# EasyEDA Pro project PCB-WearableGasDetect.epro, schematic Schematic1
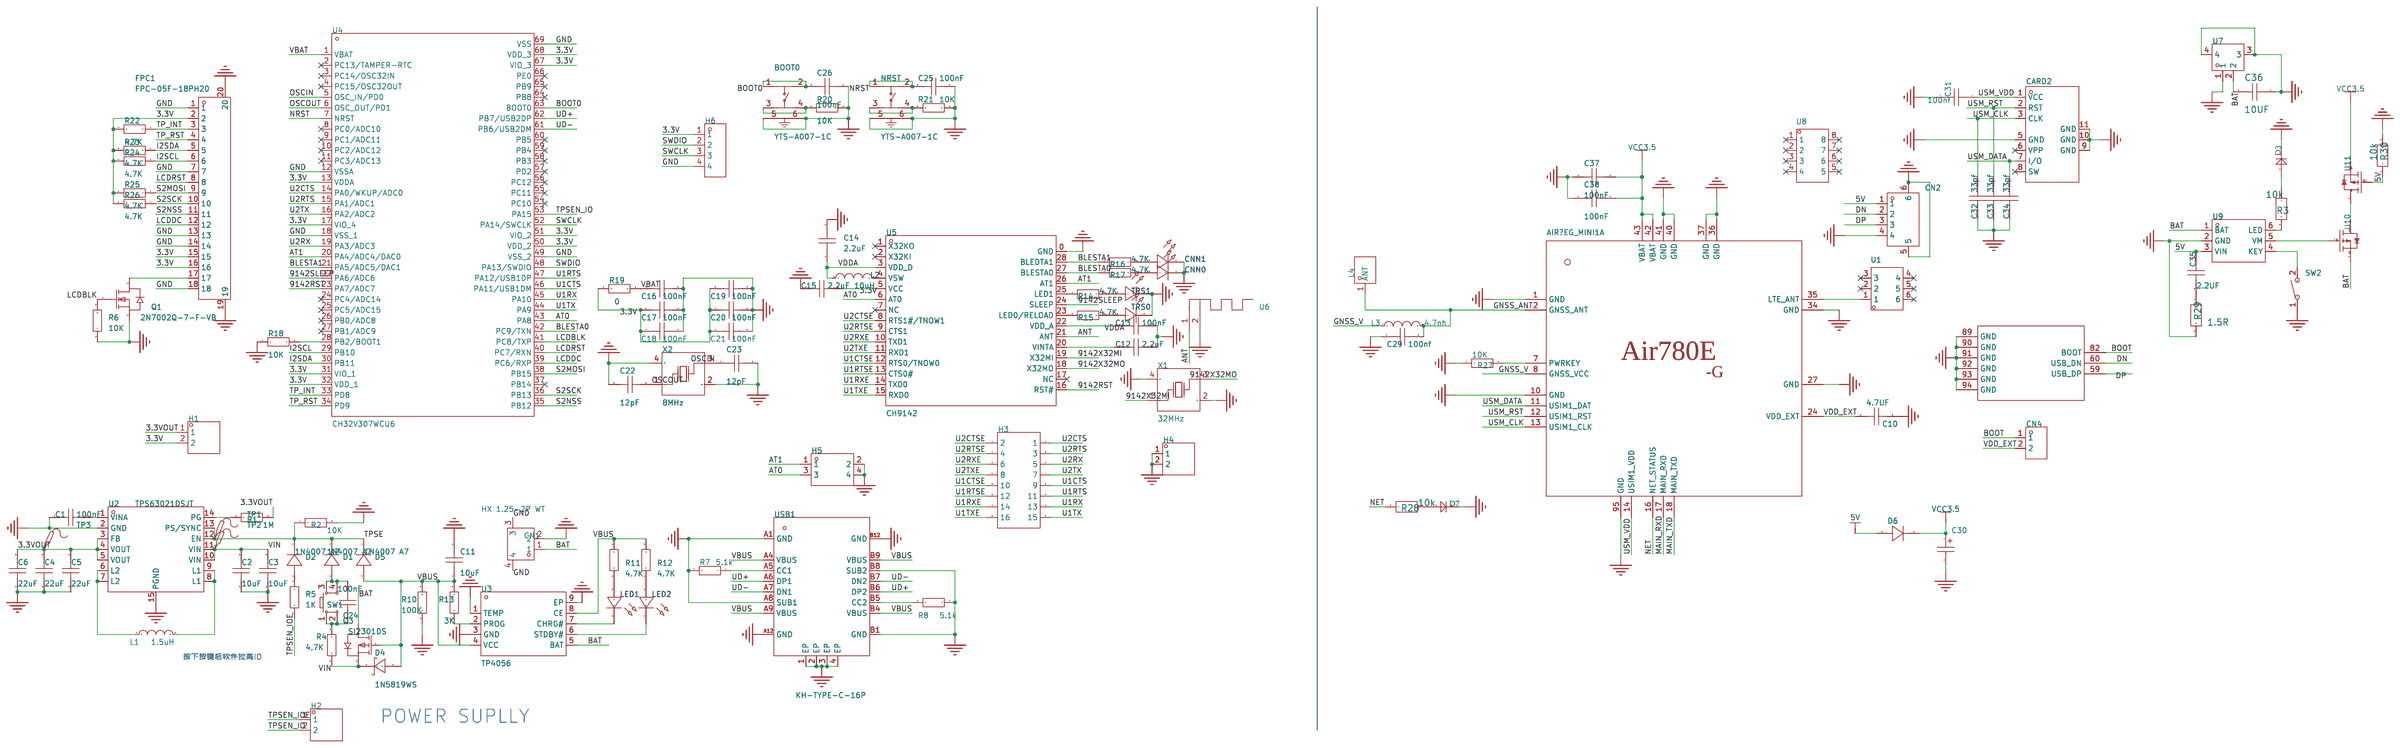
[diagram p0: schematic sheet]

## Parts
AIR?EG_MINI1  -  [Air780EG]  (section 1)
BOOT0  YTS-A007-1C  [SW-SMD_6P-L3.4-W3.4-P2.00-LS4.0]
C1  100nF  [C0402]
C2  10uF  [C0603]
C3  10uF  [C0603]
C4  22uF  [C0603]
C5  22uF  [C0603]
C6  22uF  [C0603]
C10  4.7UF  [C0603]
C11  10uF  [C0603]
C12  2.2uF  [C0402]
C13  100nF  [C0402]
C14  2.2uF  [C0402]
C15  2.2uF  [C0402]
C16  100nF  [C0402]
C17  100nF  [C0402]
C18  100nF  [C0402]
C19  100nF  [C0402]
C20  100nF  [C0402]
C21  100nF  [C0402]
C22  12pF  [C0402]
C23  12pF  [C0402]
C24  100nF  [C0402]
C25  100nF  [C0402]
C26  100nF  [C0402]
C29  100nf  [C0603]
C30  220uF  [CASE-B_3528]
C31  100nf  [C0603]
C32  33pf  [C0603]
C33  33pf  [C0603]
C34  33pf  [C0603]
C35  2.2UF  [C0603]
C36  10UF  [c0603]
C37  100nF  [C0402]
C38  100nF  [C0402]
CARD2  SMN-305-ARP7  [NANO-SIM-SMD_SMN-305-ARP7]
CN1  HX 1.25-2P WT  [CONN-SMD_2P-P1.25_HX1.25-2PWT]
CN2  HC-PH-4AWT  [CONN-SMD_4P-L2.00_HCTL_HC-PH-4AWT]
CN4  1.25-2AW  [CONN-TH_2P-P1.25_DEALON_1.25-2AW]
CNN0  -  [LED_0402]
CNN1  -  [LED_0402]
D1  1N4007 A7  [SOD-123FL_L2.8-W1.8-LS3.7-RD]
D2  1N4007 A7  [SOD-123FL_L2.8-W1.8-LS3.7-RD]
D3  LED  [led0603-rd-yellow]
D4  1N5819WS  [SOD-323_L1.8-W1.3-LS2.5-RD]
D5  1N4007 A7  [SOD-123FL_L2.8-W1.8-LS3.7-RD]
D6  1N4007W  [SOD-123FL_L3.0-W1.8-LS3.7-RD]
D7  LED  [led0603-rd-yellow]
FPC1  FPC-05F-18PH20  [FPC-SMD_18P-P0.50_FPC-05F-18PH20]
H1  -  [HDR-TH_2P-P2.54-V-M-1]
H2  -  [HDR-TH_2P-P2.54-V-M-1]
H3  -  [HDR-TH_16P-P2.54-V-F-R2-C8-S2.54-1]
H4  -  [HDR-TH_2P-P2.54-V-M-1]
H5  -  [HDR-TH_4P-P2.54-V-M-R2-C2-S2.54-1]
H6  -  [HDR-TH_4P-P2.54-V-M]
L1  1.5uH  [IND-SMD_L4.0-W4.0-A]
L2  10uH  [L0805]
L3  2.2nH  [L0603]
L4  KH-GPS181804-WY  [GPS-ANT-TH_L18.0-W18.0]
LED1  -  [LED_0402]
LED2  -  [LED_0402]
NRST  YTS-A007-1C  [SW-SMD_6P-L3.4-W3.4-P2.00-LS4.0]
Q1  2N7002Q-7-F-VB  [SOT-23-3_L2.9-W1.4-P1.90-LS2.5-BR]
Q3  SI2301DS  [SOT-23-3_L2.9-W1.3-P1.90-LS2.4-BR]
R1  1M  [R0402]
R2  10K  [R0402]
R3  10k  [r0603]
R4  4.7K  [R0402]
R5  1K  [R0402]
R6  10K  [R0402]
R7  5.1k  [R0402]
R8  5.1k  [R0402]
R10  100K  [R0603]
R11  4.7K  [R0402]
R12  4.7K  [R0402]
R13  3K  [R0603]
R14  4.7K  [R0402]
R15  4.7K  [R0402]
R16  4.7K  [R0402]
R17  4.7K  [R0402]
R18  10K  [R0402]
R19  0  [R0603]
R20  10K  [R0402]
R21  10K  [R0402]
R22  4.7K  [R0402]
R23  4.7K  [R0402]
R24  4.7K  [R0402]
R25  4.7K  [R0402]
R26  4.7K  [R0402]
R27  1Ω  [R0603]
R28  10k  [r0603]
R29  1.5R  [r0603]
R30  10k  [r0603]
SW1  -  [SW-SMD_4P-L6.0-W6.0-P4.50-LS9.0-2]
SW2  TS-1092S-B3D2-G  [SW-SMD_L6.1-W3.6-LS7.9]
TP1  -  [Test-Point-0.5mm]
TP2  -  [Test-Point-0.5mm]
TP3  -  [Test-Point-0.5mm]
TRS0  -  [LED_0402]
TRS1  -  [LED_0402]
U1  MD1506  [ANT-SMD_6P-L15.0-W6.6]
U2  TPS63021DSJT  [VSON-14_L4.0-W3.0-P0.50-BL-EP_TI_DSJ]
U3  TP4056  [ESOP-8_L4.9-W3.9-P1.27-LS6.0-BL-EP]
U4  CH32V307WCU6  [QFN-68_L8.0-W8.0-P0.40-BL-EP6.7]
U5  CH9142  [QFN-28_L4.0-W4.0-P0.40-BL-EP2.7_CH9142]
U6  -  [通用蓝牙天线]
U7  WAFER-MX1.25-2PWB  [CONN-SMD_2P-P1.25_XUNPU_WAFER-MX1.25-2PWB]
U8  MD1705  [ANT-SMD_MD1705]
U9  LY3205  [PG-SOT23-6_L2.9-W1.6-P0.95-LS2.8-BR]
U10  AO3401  [SOT-23-3_L2.9-W1.6-P1.90-LS2.8-BR]
U11  AO3401  [SOT-23-3_L2.9-W1.6-P1.90-LS2.8-BR]
USB1  KH-TYPE-C-16P  [USB-C-SMD_KH-TYPE-C-16P]
X1  32MHz  [CRYSTAL-SMD_4P-L3.2-W2.5-BL]
X2  8MHz  [CRYSTAL-SMD_4P-L3.2-W2.5-BL]

## Library data of the parts
AIR?EG_MINI1 = AIR780EG
BOOT0 NRST = YTS-A007-1C: 电路结构:单刀单掷;按钮形状:圆形按钮;作用力:160gf;安装方式:立贴;开关长度:3.4mm;开关宽度:3.35mm;开关高度:2mm;带支架:不带;触点电流:50mA;额定电压(DC):12V;绝缘电阻:100MΩ;机械寿命:10万次;; LCSC Part Name: 3.4*3.35*2mm 立贴 轻触开关; Supplier Part: C2910660; Manufacturer: YIYUAN(怡远); Supplier Footprint: SMD; Datasheet: https://atta.szlcsc.com/upload/public/pdf/source/20211115/F701EB4F96D863066ABC82C6FE41162B.pdf; Supplier: LCSC; Circuit: 单刀单掷; Actuator Style: 圆形按钮; Operating Force: 160gf; Mounting Style: 立贴; Switch Length: 3.4mm; Switch Width: 3.35mm; Switch Height: 2mm; Strike Gundam: 不带; Contact Current: 50mA; Voltage Rating (DC): 12V; Insulation Resistance: 100MΩ; Actuator/Cap Color: 黑色; Pin Style: SMD接片; Mechanical Life: 10万次
C1 C12-C26 C37 C38 = CAP_0402: Supplier Footprint: 0402
C2-C6 C11 = CAP_0603: Supplier Footprint: 0603
C10 C29 C31-C35 = C0603: LCSC Part Name: 0603; Supplier Part: C9900021180; Manufacturer Part: 0603; JLCPCB Part Class: Extended Part; Datasheet: https://atta.szlcsc.comnull; Supplier: LCSC
C30 = TLJB227M006R0500: 容值:220uF;精度:±20%;额定电压:6.3V;等效串联电阻:500mΩ@100kHz;; LCSC Part Name: 220uF ±20% 6.3V; Supplier Part: C30242; Manufacturer: Kyocera AVX; Supplier Footprint: CASE-B-3528; JLCPCB Part Class: Extended Part; Datasheet: https://atta.szlcsc.com/upload/public/pdf/source/20181016/C313517_95E099C94D57B8A6005DAF15C3058A23.pdf; Supplier: LCSC; Tolerance: ±20%; Rated Voltage: 6.3V; Equivalent Series Resistance(ESR): 500mΩ@100kHz; Operating Temperature: -55~+125
C36 = 10UF: link: https://item.szlcsc.com/362304.html; 3DModel: C0603_L1.6-W0.8-H0.8
CARD2 = SMN-305-ARP7: 卡连接方式:翻盖式;卡类型:NanoSIM卡;连接器类型:卡座;本体最大高度:1.4mm;触头材质:磷铜;触头镀层:金;工作温度范围:-25~+85;焊接温度(最大值):260;; LCSC Part Name: 翻盖式 NanoSIM卡 卡座; Supplier Part: C720512; Manufacturer: XUNPU(讯普); Supplier Footprint: SMD; JLCPCB Part Class: Extended Part; Datasheet: https://atta.szlcsc.com/upload/public/pdf/source/20210906/1E62678A42BE1E594705537ECE0FD854.pdf; Supplier: LCSC; Card Connection Mode: 翻盖式; Card Type: NanoSIM卡; Connector Type: 卡座; Body Height (Max): 1.4mm; Contact Material: 磷铜; Contact Plating: 金; Operating Temperature Range: -25~+85; Soldering Temperature(Max): 260
CN1 = HX 1.25-2P WT: 插针结构:1x2P;间距:1.25mm;安装方式:卧贴;总PIN数:2P;排数:1;每排PIN数:2;额定电流:1A;工作温度范围:-25℃~+85℃;; LCSC Part Name: 1x2P 间距:1.25mm 卧贴; Supplier Part: C5142069; Manufacturer: hanxia(韩下); Supplier Footprint: SMD,P=1.25mm,卧贴; Datasheet: https://atta.szlcsc.com/upload/public/pdf/source/20220818/902167240A14414EBE70E0F5623727B7.pdf; Supplier: LCSC; Pins Structure: 1x2P; Pitch: 1.25mm; Mounting Style: 卧贴; Number of Pins: 2P; Number of Rows: 1; Number of PINs Per Row: 2; Current Rating (Max): 1A; Operating Temperature Range: -25℃~+85℃
CN2 = HC-PH-4AWT: 插针结构:1x4P;间距:2mm;安装方式:卧贴;参考系列:-;总PIN数:4P;排数:1;每排PIN数:4;行距:-;额定电流:2A;触头材质:黄铜;触头镀层:锡;工作温度范围:-25~+85;; LCSC Part Name: 1x4P 间距:2mm 卧贴; Supplier Part: C2845444; Manufacturer: HCTL(华灿天禄); Supplier Footprint: SMD,P=2mm,卧贴; JLCPCB Part Class: Extended Part; Datasheet: https://atta.szlcsc.com/upload/public/pdf/source/20230707/C76C29BC6B4F6826E0E1F0C919A68071.pdf; Supplier: LCSC; Pins Structure: 1x4P; Pitch: 2mm; Mounting Style: 卧贴; Number of Pins: 4P; Number of Rows: 1; Number of PINs Per Row: 4; Current Rating (Max): 2A; Contact Material: 黄铜; Contact Plating: 锡; Operating Temperature Range: -25~+85
CN4 = 1.25-2AW: 插针结构:1x2P;间距:1.25mm;安装方式:-;参考系列:-;总PIN数:2P;排数:1;每排PIN数:2;行距:-;额定电流:1A;工作温度范围:-25℃~+85℃;; LCSC Part Name: 1x2P 间距:1.25mm; Supplier Part: C2904948; Manufacturer: DEALON(德艺隆); Supplier Footprint: P=1.25mm; JLCPCB Part Class: 扩展库; Datasheet: https://atta.szlcsc.com/upload/public/pdf/source/20211108/053240F9E07FB918E1C17982C26F454E.pdf; Supplier: LCSC; Pins Structure: 1x2P; Pitch: 1.25mm; Number of Pins: 2P; Number of Rows: 1; Number of PINs Per Row: 2; Current Rating (Max): 1A; Operating Temperature Range: -25℃~+85℃
CNN0 CNN1 LED1 LED2 TRS0 TRS1 = LED_0402-B: Supplier Footprint: 0402
D1 D2 D5 = 1N4007 A7: 二极管配置:-;正向压降(Vf):1V@1A;直流反向耐压(Vr):1kV;整流电流:1A;; LCSC Part Name: 电压:1kV 电流:1A; Supplier Part: C2902912; Manufacturer: MSKSEMI(美森科); Supplier Footprint: SOD-123FL; Datasheet: https://atta.szlcsc.com/upload/public/pdf/source/20240508/1829C9D8507EFBB572682FFAB90585C9.pdf; Supplier: LCSC; Forward Voltage (Vf@If): 1V@1A; Reverse Voltage (Vr): 1kV; Rectified Current: 1A; Reverse Leakage Current: 10uA@1kV
D3 D7 = LED: link: https://atta.szlcsc.com/upload/public/pdf/source/20180129/C125100_15171877314981315871.pdf; 3DModel: LED0603-RD-YELLOW
D4 = 1N5819WS_C191023: 正向压降(Vf):600mV@1A;直流反向耐压(Vr):40V;整流电流:1A;; LCSC Part Name: 电压:40V 电流:1A; Supplier Part: C191023; Manufacturer: Hottech(合科泰); Supplier Footprint: SOD-323; JLCPCB Part Class: 基础库; Datasheet: https://atta.szlcsc.com/upload/public/pdf/source/20220428/3CB86FD8D28D653594B4E35F9D5AEFD9.pdf; Supplier: LCSC; Forward Voltage (Vf@If): 600mV@1A; Reverse Voltage (Vr): 40V; Rectified Current: 1A
D6 = 1N4007W: 二极管配置:独立式;正向压降(Vf):1.1V@1A;直流反向耐压(Vr):1kV;平均整流电流(Io):1A;; LCSC Part Name: 电压:1kV 电流:1A; Supplier Part: C1884540; Manufacturer: YFW(佑风微); Supplier Footprint: SOD-123FL; JLCPCB Part Class: Extended Part; Datasheet: https://atta.szlcsc.com/upload/public/pdf/source/20210111/C1884540_34023FB1177673FEBA54AA4E559D88AC.pdf; Supplier: LCSC; Diode Configuration: 独立式; Forward Voltage (Vf@If): 1.1V@1A; Reverse Voltage (Vr): 1kV; Average Rectified Current (Io): 1A; Reverse Leakage Current: 5uA
FPC1 = FPC-05F-18PH20: 锁定特性:翻盖式;触点类型:下接;触点数量:18P;间距:0.5mm;安装类型:卧贴;工作温度范围:-25℃~+85℃;; LCSC Part Name: 间距:0.5mm P数:18P 翻盖式 下接; Supplier Part: C2856802; Manufacturer: XUNPU(讯普); Supplier Footprint: SMD,P=0.5mm,卧贴; Datasheet: https://atta.szlcsc.com/upload/public/pdf/source/20210922/C2856802_2A845D1961F33AEC1ED22CECB292335F.pdf; Supplier: LCSC; Locking Feature: 翻盖式; Contact Type: 下接; Number of Contacts: 18P; Pitch: 0.5mm; Mounting Type: 卧贴; FFC, FCB Thickness: 0.3mm; Height Above Board: 2mm; Operating Temperature Range: -25℃~+85℃
H1 H2 H4 = HDR-M_2.54_1x2P: Supplier Part: C124375; Supplier Footprint: 插件
H3 = HDR-F_2.54_2x8: Supplier Part: C30734; Supplier Footprint: 插件
H5 = HDR-M_2.54_2x2: Supplier Part: C160338; Supplier Footprint: 插件,P=2.54mm
H6 = HDR-M_2.54_1x4P: Supplier Part: C492403; Supplier Footprint: 插件
L1 = XFL4020-152MEC: 电感值:1.5uH;精度:±20%;额定电流:-;饱和电流(Isat):-;类型:-;; LCSC Part Name: 1.5uH ±20%; Supplier Part: C3033018; Manufacturer: Coilcraft(线艺); Supplier Footprint: SMD,4x4mm; Supplier: LCSC; Tolerance: ±20%
L2 = L_0805
L3 = LQW18AN2N2D00D: 电感值:2.2nH;额定电流:700mA;饱和电流(Isat):-;; Supplier Part: C189922; Manufacturer: muRata(村田); Supplier Footprint: 0603; JLCPCB Part Class: Extended Part; Datasheet: https://atta.szlcsc.com/upload/public/pdf/source/20190301/C337910_27DA25781C95F885577870A93A746ADF.pdf; Supplier: LCSC; Rated Current: 700mA; DC Resistance (DCR): 42mΩ
L4 = KH-GPS181804-WY: GPS无源陶瓷天线，尺寸18*18*4mm，频率1575.42MHZ; LCSC Part Name: GPS无源陶瓷天线，尺寸18*18*4mm，频率1575.42MHZ; Supplier Part: C962215; Manufacturer: kinghelm(金航标); JLCPCB Part Class: Extended Part; Datasheet: https://atta.szlcsc.com/upload/public/pdf/source/20201126/C962215_82E5E1E940262DCAC0E44B55C5AE8EC3.pdf; Supplier: LCSC
Q1 = 2N7002Q-7-F-VB: 类型:1个N沟道;漏源电压(Vdss):60V;连续漏极电流(Id):250mA;导通电阻(RDS(on)@Vgs,Id):-;功率(Pd):300mW;阈值电压(Vgs(th)@Id):2.5V@250uA;; LCSC Part Name: 1个N沟道 耐压:60V 电流:250mA; Supplier Part: C7525052; Manufacturer: VBsemi(微碧半导体); Supplier Footprint: SOT-23; JLCPCB Part Class: 扩展库; Datasheet: https://atta.szlcsc.com/upload/public/pdf/source/20240805/684F38D9FB1B3C1C5956752768C211FC.pdf; Supplier: LCSC; Type: 1个N沟道; Drain Source Voltage (Vdss): 60V; Continuous Drain Current (Id): 250mA; Power Dissipation (Pd): 300mW; Gate Threshold Voltage (Vgs(th)@Id): 2.5V@250uA; Total Gate Charge (Qg@Vgs): 400pC@4.5V; Input Capacitance (Ciss@Vds): 25pF@25V; Reverse Transfer Capacitance (Crss@Vds): 2pF@25V; Operating Temperature: -55℃~+150℃@(Tj)
Q3 = SI2301DS: 类型:-;漏源电压(Vdss):20V;连续漏极电流(Id):3A;导通电阻(RDS(on)@Vgs,Id):110mΩ@4.5V,3A;功率(Pd):1W;阈值电压(Vgs(th)@Id):1V@250uA;; LCSC Part Name: 耐压:20V 电流:3A; Supplier Part: C2841444; Manufacturer: TECH PUBLIC(台舟); Supplier Footprint: SOT-23-3; JLCPCB Part Class: 扩展库; Datasheet: https://atta.szlcsc.com/upload/public/pdf/source/20210623/C2841444_F8915202D3D7667D175CCC150AA2E443.pdf; Supplier: LCSC; Drain Source Voltage (Vdss): 20V; Continuous Drain Current (Id): 3A; Drain Source On Resistance (RDS(on)@Vgs,Id): 110mΩ@4.5V,3A; Power Dissipation (Pd): 1W; Gate Threshold Voltage (Vgs(th)@Id): 1V@250uA; Total Gate Charge (Qg@Vgs): 12nC@10V; Input Capacitance (Ciss@Vds): 405pF@10V; Reverse Transfer Capacitance (Crss@Vds): 55pF@10V; Operating Temperature: -55℃~+150℃
R1 R2 R4-R8 R11 R12 R14-R18 R20-R26 = Res_0402: Supplier Footprint: 0402
R3 R28-R30 = 1k: 3DModel: R0603_L1.6-W0.8-H0.8; link: https://www.mouser.in/datasheet/2/447/PYu_RT_1_to_0_01_RoHS_L_11-1669912.pdf
R10 R13 R19 = Res_0603: Supplier Footprint: 0603
R27 = 0603WAF100KT5E: 阻值:1Ω;精度:±1%;功率:100mW;温度系数:±400ppm/;电阻类型:厚膜电阻;; LCSC Part Name: 1Ω ±1% 100mW 厚膜电阻; Supplier Part: C22936; Manufacturer: UNI-ROYAL(厚声); Supplier Footprint: 0603; JLCPCB Part Class: Basic Part; Datasheet: https://atta.szlcsc.com/upload/public/pdf/source/20200306/C422600_1E6D84923E4A46A82E41ADD87F860B5C.pdf; Supplier: LCSC; Tolerance: ±1%; Power(Watts): 100mW; Overload Voltage (Max): 75V; Temperature Coefficient: ±400ppm/; Type: 厚膜电阻; Operating Temperature Range: -55~+155
SW1 = Key_SMD_6x6x6.5: Supplier Footprint: SMD
SW2 = TS-1092S-B3D2-G: 电路结构:单刀单掷;按钮形状:矩形按钮;作用力:250gf;安装方式:立贴;开关长度:6.1mm;开关宽度:3.6mm;开关高度:2.5mm;带支架:不带;机械寿命:-;; LCSC Part Name: 6.1*3.6*2.5mm 立贴 轻触开关; Supplier Part: C520860; Manufacturer: Yuandi(元迪); Supplier Footprint: SMD; JLCPCB Part Class: Extended Part; Datasheet: https://atta.szlcsc.com/upload/public/pdf/source/20200424/C520860_DA5AE47D9A9DC527FC720B5FF0895739.pdf; Supplier: LCSC; Circuit: 单刀单掷; Actuator Style: 矩形按钮; Operating Force: 250gf; Mounting Style: 立贴; Switch Length: 6.1mm; Switch Width: 3.6mm; Switch Height: 2.5mm; Strike Gundam: 不带; Actuator/Cap Color: 灰色; Pin Style: 鸥翼型
TP1-TP3 = Test-Point: Test Point 测试点
U1 = MD1506: Supplier Part: C239245; Manufacturer: rainsun(霖昱微); Supplier Footprint: SMD; JLCPCB Part Class: Extended Part; Datasheet: https://atta.szlcsc.com/upload/public/pdf/source/20180730/C239245_D6CEC2DBD4C7F8D4BD9841FDF54C9ABC.pdf; Supplier: LCSC
U2 = TPS63021DSJT: 功能类型:升降压型;输出类型:固定;输入电压:1.8V~5.5V;输出电压:3.3V;输出电流:3.5A;; Supplier Part: C2070616; Manufacturer: TI(德州仪器); Supplier Footprint: VSON-14-EP(3x4); Datasheet: https://www.ti.com/cn/lit/gpn/tps63021; Supplier: LCSC; Function: 升降压型; Output Type: 固定; Input Voltage: 1.8V~5.5V; Output Voltage: 3.3V; Output Current: 3.5A; Switching Frequency: 2.4MHz; Operating Temperature: -40℃~+85℃@(TA); Synchronous Rectification: 是; Number of Outputs: 1; Topology: 降压-升压式; Switch tube (built-in/external): 内置
U3 = TP4056_C725790: Supplier Part: C725790; Manufacturer: UMW(友台半导体); Supplier Footprint: ESOP-8; Datasheet: https://atta.szlcsc.com/upload/public/pdf/source/20231109/CF74897CE79A500F7FE27A45ADCCC631.pdf; Supplier: LCSC
U4 = CH32V307WCU6: Supplier Part: C5142795; Manufacturer: WCH(南京沁恒); Supplier Footprint: QFN-68(8x8); JLCPCB Part Class: 扩展库; Datasheet: https://atta.szlcsc.com/upload/public/pdf/source/20240313/87C13A8CF5EF858FFEC719C949A2FB12.pdf; Supplier: LCSC
U5 = CH9142: 接口:SPI；UART;应用领域:蓝牙;数据速率:1Mbps;; Supplier Part: C39831289; Manufacturer: WCH(南京沁恒); Supplier Footprint: QFN-28(4x4); JLCPCB Part Class: 扩展库; Datasheet: https://atta.szlcsc.com/upload/public/pdf/source/20240807/14B997D2025695D367C6ADC3BA92D1D2.pdf; Supplier: LCSC; Interface: SPI；UART; Operating Voltage: 2.3V~3.6V; Applications: 蓝牙; Output Power: -20dBm; Data Rate: 1Mbps; Operating Temperature: -40℃~+85℃
U6 = 蓝牙天线: _: undefined
U7 = WAFER-MX1.25-2PWB: 插针结构:1x2P;间距:1.25mm;安装方式:卧贴;总PIN数:2P;排数:1;每排PIN数:2;额定电流:1A;工作温度范围:-25℃~+85℃;; LCSC Part Name: 1x2P 间距:1.25mm 卧贴; Supplier Part: C3029359; Manufacturer: XUNPU(讯普); Supplier Footprint: SMD,P=1.25mm,卧贴; JLCPCB Part Class: 扩展库; Datasheet: https://atta.szlcsc.com/upload/public/pdf/source/20220527/5ACBB683E384B6AD06743F272F933620.pdf; Supplier: LCSC; Pins Structure: 1x2P; Pitch: 1.25mm; Mounting Style: 卧贴; Number of Pins: 2P; Number of Rows: 1; Number of PINs Per Row: 2; Current Rating (Max): 1A; Operating Temperature Range: -25℃~+85℃
U8 = MD1705: 带点的下面那个脚， 为信号输入脚， 其他的脚仅仅作为固定用，不能接地; Supplier Part: C239246; Manufacturer: rainsun(霖昱微); Supplier Footprint: SMD; JLCPCB Part Class: Extended Part; Datasheet: https://atta.szlcsc.com/upload/public/pdf/source/20180730/C239246_185973EF77720E07F7023A22F36B1E74.pdf; Supplier: LCSC
U9 = LY3205: Supplier Part: C9900091618; Supplier Footprint: SOT23-6; Supplier: LCSC
U10 U11 = AO3401: Supplier Part: C9900008520; Supplier Footprint: SOT-23; JLCPCB Part Class: 扩展库; Supplier: LCSC
USB1 = KH-TYPE-C-16P: 连接器类型:Type-C;标准:-;公母:母;端口数量:1;触点数量:16P;安装方式:卧贴;额定电流 - 电源:3A;工作温度范围:-40℃~+85℃;; LCSC Part Name: Type-C 母 卧贴; Supplier Part: C709357; Manufacturer: kinghelm(金航标); Supplier Footprint: SMD; Datasheet: https://atta.szlcsc.com/upload/public/pdf/source/20200911/C709357_AA8DCEB38BB20E3035A7ED7AE7667837.pdf; Supplier: LCSC; Connector Type: Type-C; Gender: 母; Number of Ports: 1; Number of Contacts: 16P; Mounting Style: 卧贴; Current Rating - Power (Max): 3A; Operating Temperature Range: -40℃~+85℃
X1 X2 = X322532MOB4SI: 晶振类型:贴片晶振;频率:32MHz;常温频差:±10ppm;外接负载电容:12pF;频率稳定度(全温):±20ppm;; LCSC Part Name: 32MHz ±10ppm 12pF; Supplier Part: C9009; Manufacturer: YXC(扬兴晶振); Supplier Footprint: SMD3225-4P; Datasheet: https://atta.szlcsc.com/upload/public/pdf/source/20240329/19D5F850207469550BEB00D7DFEDBC7A.pdf; Supplier: LCSC; Crystal Type: 贴片晶振; Normal temperature Frequency Tolerance: ±10ppm; External load capacitor: 12pF; Frequency Stability(Full temperature range): ±20ppm; Operating Temperature: -40℃~+85℃

## Nets
3.3V: C15.2 C17.1 C18.1 C19.1 C20.1 C21.1 FPC1.2 FPC1.15 FPC1.16 H1.2 H6.1 R19.1 R22.2 R23.2 R24.2 R25.2 R26.2 U4.13(VDDA) U4.17(VIO_4) U4.31(VIO_1) U4.32(VDD_1) U4.50(VDD_2) U4.51(VIO_2) U4.67(VIO_3) U4.68(VDD_3) U5.5(VCC)
3.3VOUT: C4.2 C5.2 C6.2 H1.1 R1.2 TP3.1 U2.3(FB) U2.4(VOUT) U2.5(VOUT)
5V: C35.2 CN2.1 D6.2(A) R30.1 U9.3(VIN) U11.1(G)
GND: AIR?EG_MINI1.1(GND) AIR?EG_MINI1.10(GND) AIR?EG_MINI1.27(GND) AIR?EG_MINI1.34(GND) AIR?EG_MINI1.36(GND) AIR?EG_MINI1.37(GND) AIR?EG_MINI1.40(GND) AIR?EG_MINI1.41(GND) AIR?EG_MINI1.89(GND) AIR?EG_MINI1.90(GND) AIR?EG_MINI1.91(GND) AIR?EG_MINI1.92(GND) AIR?EG_MINI1.93(GND) AIR?EG_MINI1.94(GND) AIR?EG_MINI1.95(GND) BOOT0.5(GND) BOOT0.6(GND) C1.1 C2.1 C3.1 C4.1 C5.1 C6.1 C10.2 C11.1 C12.2 C13.2 C14.2 C15.1 C16.2 C17.2 C18.2 C19.2 C20.2 C21.2 C22.1 C23.2 C25.1 C26.1 C29.1 C30.2 C31.2 C32.1 C33.1 C34.1 C36.1 C37.1 C38.1 CARD2.5(GND) CARD2.9(GND) CARD2.10(GND) CARD2.11(GND) CN1.2 CN1.3 CN1.4 CN2.4 CN2.5 CN2.6 CNN0.1(C) CNN1.1(C) D3.1(A) D7.1(A) FPC1.1 FPC1.7 FPC1.13 FPC1.14 FPC1.18 FPC1.19 FPC1.20 H4.1 H4.2 H5.2 H5.4 H6.4 NRST.5(GND) NRST.6(GND) Q1.2(S) R2.2 R6.1 R7.2 R8.1 R10.1 R18.1 R20.2 R21.2 R27.1 R29.2 R30.2 SW2.1 TRS0.1(C) TRS1.1(C) U2.2(GND) U2.15(PGND) U3.1(TEMP) U3.3(GND) U3.9(EP) U4.12(VSSA) U4.18(VSS_1) U4.49(VSS_2) U4.69(VSS) U5.0(GND) U6.2 U7.1 U7.3 U7.4 U9.2(GND) USB1.1(EP) USB1.2(EP) USB1.3(EP) USB1.4(EP) USB1.A1(GND) USB1.A8(SUB1) USB1.A12(GND) USB1.B1(GND) USB1.B8(SUB2) USB1.B12(GND) X1.2(GND) X1.4(GND) X2.2(GND) X2.4(GND)
VBAT: C16.1 R19.2 U4.1(VBAT)
VBUS: C11.2 D4.2(A) D5.2(A) Q3.1(G) R10.2 R11.1 R12.1 R13.2 U3.4(VCC) U3.8(CE) USB1.A4(VBUS) USB1.A9(VBUS) USB1.B4(VBUS) USB1.B9(VBUS)
VCC3.5: AIR?EG_MINI1.42(VBAT) AIR?EG_MINI1.43(VBAT) C30.1 C37.2 C38.2 D6.1(K) U11.2(S)
VDD_EXT: AIR?EG_MINI1.24(VDD_EXT) C10.1 CN4.2
VDDA: C13.1 C14.1 L2.1 U5.3(VDD_D) U5.22(VDD_A)
VIN: C2.2 C3.2 D4.1(K) Q3.2(S) R4.2 TP2.1 U2.10(VIN) U2.11(VIN)
9142RST: U4.23(PA7/ADC7) U5.16(RST#)
9142SLEEP: U4.22(PA6/ADC6) U5.24(SLEEP)
9142X32MI: U5.19(X32MI) X1.1(OSC1)
9142X32MO: U5.18(X32MO) X1.3(OSC2)
ANT: U5.21(ANT) U6.1
AT0: H5.3 U4.43(PA8) U5.6(AT0)
AT1: H5.1 U4.20(PA4/ADC4/DAC0) U5.26(AT1)
BAT: C36.2 CN1.1 Q3.3(D) U3.5(BAT) U7.2 U9.1(BAT) U10.2(S)
BLESTA0: R17.1 U4.42(PC9/TXN) U5.27(BLESTA0)
BLESTA1: R16.1 U4.21(PA5/ADC5/DAC1) U5.28(BLEDTA1)
BOOT: AIR?EG_MINI1.82(BOOT) CN4.1
BOOT0: BOOT0.1 BOOT0.2 C26.2 U4.63(BOOT0)
DN: AIR?EG_MINI1.60(USB_DN) CN2.2
DP: AIR?EG_MINI1.59(USB_DP) CN2.3
GNSS_ANT: AIR?EG_MINI1.2(GNSS_ANT) C29.2 L3.2 L4.1(ANT)
GNSS_V: AIR?EG_MINI1.8(GNSS_VCC) L3.1
I2SCL: FPC1.6 R24.1 U4.29(PB10)
I2SDA: FPC1.5 R23.1 U4.30(PB11)
LCDBLK: Q1.1(G) R6.2 U4.41(PC8/TXP)
LCDDC: FPC1.12 U4.39(PC6/RXP)
LCDRST: FPC1.8 U4.40(PC7/RXN)
MAIN_RXD: AIR?EG_MINI1.17(MAIN_RXD)
MAIN_TXD: AIR?EG_MINI1.18(MAIN_TXD)
NET: AIR?EG_MINI1.16(NET_STATUS) R28.2
NRST: C25.2 NRST.1 NRST.2 U4.7(NRST)
OSCIN: C23.1 U4.5(OSC_IN/PD0) X2.3(OSC2)
OSCOUT: C22.2 U4.6(OSC_OUT/PD1) X2.1(OSC1)
S2MOSI: FPC1.9 R25.1 U4.38(PB15)
S2NSS: FPC1.11 U4.35(PB12)
S2SCK: FPC1.10 R26.1 U4.36(PB13)
SWCLK: H6.3 U4.52(PA14/SWCLK)
SWDIO: H6.2 U4.48(PA13/SWDIO)
TP_INT: FPC1.3 R22.1 U4.33(PD8)
TP_RST: FPC1.4 U4.34(PD9)
TPSE: D1.1(K) D2.1(K) D5.1(K) R2.1 TP1.1 U2.12(EN) U2.13(PS/SYNC)
TPSEN_IO: H2.2 U4.53(PA15)
TPSEN_IOE: H2.1 R5.2
U1CTS: H3.9 U4.46(PA11/USB1DM)
U1CTSE: H3.10 U5.12(RTS0/TNOW0)
U1RTS: H3.11 U4.47(PA12/USB1DP)
U1RTSE: H3.12 U5.13(CTS0#)
U1RX: H3.13 U4.45(PA10)
U1RXE: H3.14 U5.14(TXD0)
U1TX: H3.15 U4.44(PA9)
U1TXE: H3.16 U5.15(RXD0)
U2CTS: H3.1 U4.14(PA0/WKUP/ADC0)
U2CTSE: H3.2 U5.8(RTS1#/TNOW1)
U2RTS: H3.3 U4.15(PA1/ADC1)
U2RTSE: H3.4 U5.9(CTS1)
U2RX: H3.5 U4.19(PA3/ADC3)
U2RXE: H3.6 U5.10(TXD1)
U2TX: H3.7 U4.16(PA2/ADC2)
U2TXE: H3.8 U5.11(RXD1)
UD+: U4.62(PB7/USB2DP) USB1.A6(DP1) USB1.B6(DP2)
UD-: U4.61(PB6/USB2DM) USB1.A7(DN1) USB1.B7(DN2)
USM_CLK: AIR?EG_MINI1.13(USIM1_CLK) C32.2 CARD2.3(CLK)
USM_DATA: AIR?EG_MINI1.11(USIM1_DAT) C34.2 CARD2.7(I/O)
USM_RST: AIR?EG_MINI1.12(USIM1_RST) C33.2 CARD2.2(RST)
USM_VDD: AIR?EG_MINI1.14(USIM1_VDD) C31.1 CARD2.1(VCC)
$1N1613: L1.1 U2.6(L2) U2.7(L2)
$1N1618: L1.2 U2.8(L1) U2.9(L1)
$1N2228: R1.1 U2.14(PG)
$1N2253: C1.2 U2.1(VINA)
$1N4933: FPC1.17 Q1.3(D)
$1N5483: R8.2 USB1.B5(CC2)
$1N5485: R7.1 USB1.A5(CC1)
$1N6205: D2.2(A) R5.1
$1N7410: LED1.1(C) U3.7(CHRG#)
$1N7413: LED2.1(C) U3.6(STDBY#)
$1N7423: LED1.2(A) R11.2
$1N7425: LED2.2(A) R12.2
$1N7557: R13.1 U3.2(PROG)
$1N9478: R18.2 U4.28(PB2/BOOT1)
$1N10386: R14.1 U5.25(LED1)
$1N10412: R15.1 U5.23(LED0/RELOAD)
$1N10463: R15.2 TRS0.2(A)
$1N10490: R14.2 TRS1.2(A)
$1N10629: CNN1.2(A) R16.2
$1N10680: CNN0.2(A) R17.2
$1N10807: C12.1 U5.20(VINTA)
$1N11164: L2.2 U5.4(VSW)
$1N14303: C24.2 D1.2(A) SW1.3 SW1.4
$1N14308: C24.1 R4.1 SW1.1 SW1.2
$1N19058: NRST.3 NRST.4 R21.1
$1N19067: BOOT0.3 BOOT0.4 R20.1
$1N23713: D7.2(K) R28.1
$1N23716: U9.5(VM) U10.1(G)
$1N23725: C35.1 R29.1
$1N23727: SW2.2 U9.4(KEY)
$1N23728: R3.2 U9.6(LED)
$1N23729: U10.3(D) U11.3(D)
$1N23735: D3.2(K) R3.1
$1N23743: AIR?EG_MINI1.7(PWRKEY) R27.2
$1N23755: AIR?EG_MINI1.35(LTE_ANT) U1.1

Not connected (* = marked no-connect by the designer): CARD2 6(VPP)* 8(SW)*; U1 2* 3* 4* 5* 6*; U4 2(PC13/TAMPER-RTC)* 3(PC14/OSC32IN)* 4(PC15/OSC32OUT)* 8(PC0/ADC10)* 9(PC1/ADC11)* 10(PC2/ADC12)* 11(PC3/ADC13)* 24(PC4/ADC14)* 25(PC5/ADC15)* 26(PB0/ADC8)* 27(PB1/ADC9)* 37(PB14)* 54(PC10)* 55(PC11)* 56(PC12)* 57(PD2)* 58(PB3)* 59(PB4)* 60(PB5)* 64(PB8)* 65(PB9)* 66(PE0)*; U5 1(X32KO)* 2(X32KI)* 7(NC)* 17(NC)*; U8 1* 2* 3* 4* 5* 6* 7* 8*

## Notes on the sheet
- 按下按键后软件拉高IO
- POWER SUPLLY
